# Altium project stm32.PrjPcb
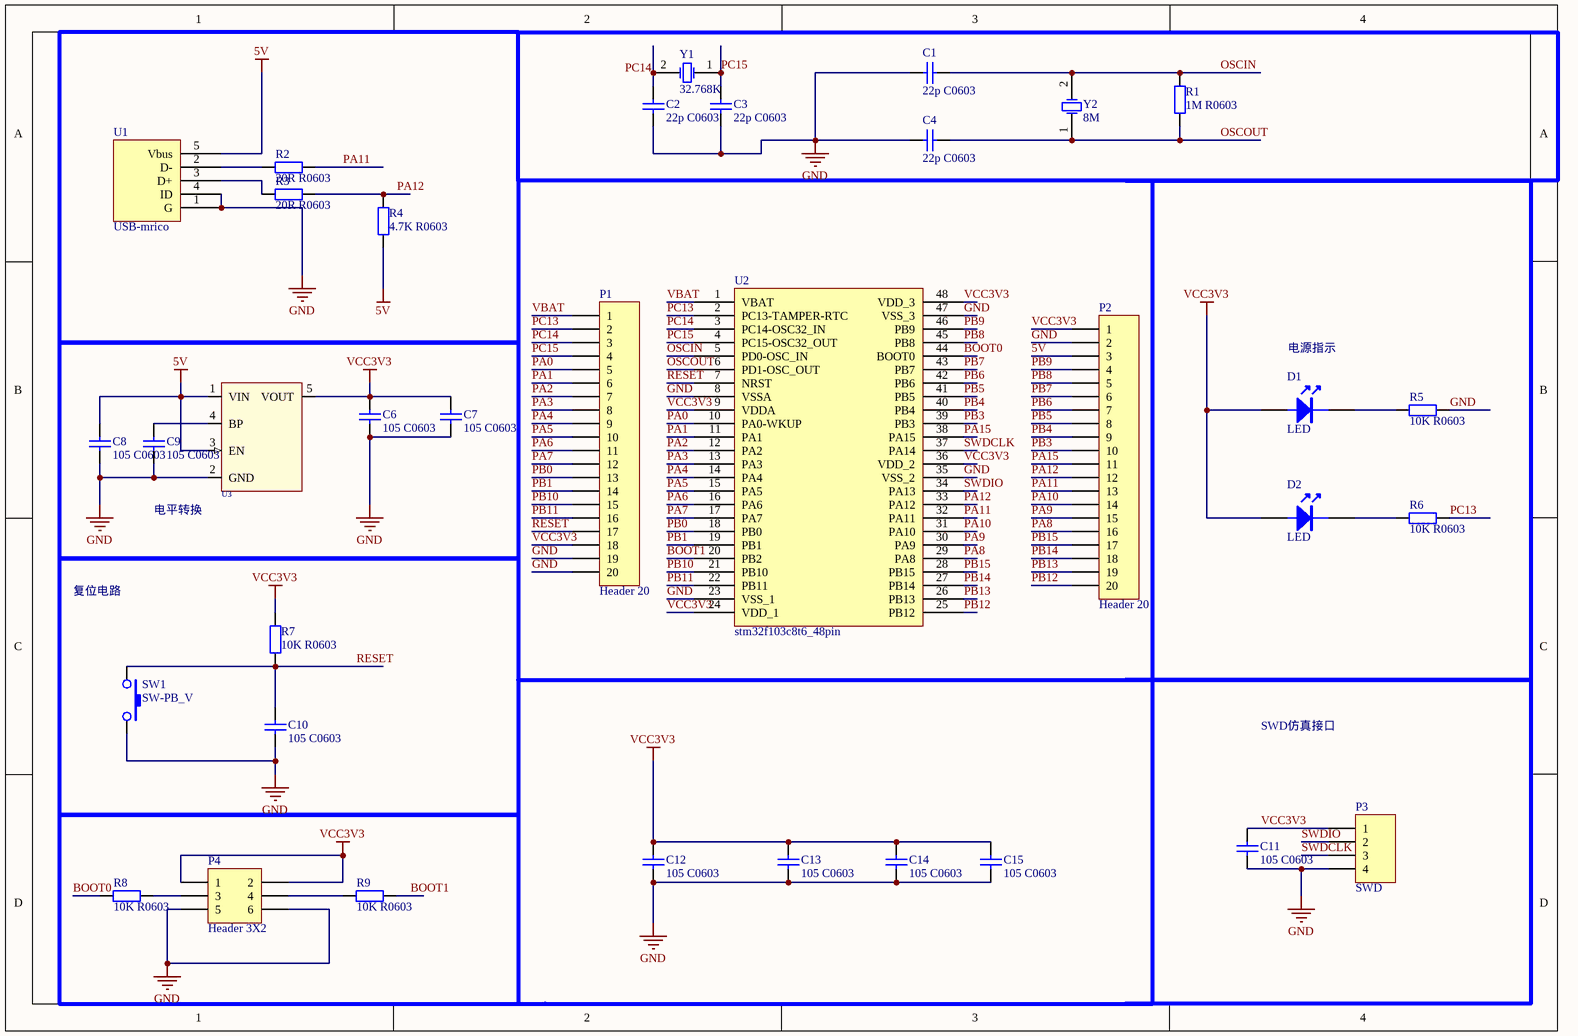
[diagram p0: stm32.SchDoc]
1 sheet, 35 parts. Net scope: global (net labels, ports and power ports of the same name join across sheets).
Board file: stm32.PcbDoc

## Sheet stm32.SchDoc
size A4

### Parts
C1  22p C0603  [C 0603]
C2  22p C0603  [C 0603]
C3  22p C0603  [C 0603]
C4  22p C0603  [C 0603]
C6  105 C0603  [C 0603]
C7  105 C0603  [C 0603]
C8  105 C0603  [C 0603]
C9  105 C0603  [C 0603]
C10  105 C0603  [C 0603]
C11  105 C0603  [C 0603]
C12  105 C0603  [C 0603]
C13  105 C0603  [C 0603]
C14  105 C0603  [C 0603]
C15  105 C0603  [C 0603]
D1  LED  [LED 0805G]
D2  LED  [LED 0805G]
P1  Header 20  [HDR1X20]
P2  Header 20  [HDR1X20]
P3  SWD  [HDR-1X4_H]
P4  Header 3X2  [HDR-3X2]
R1  1M R0603  [R 0603]
R2  20R R0603  [R 0603]
R3  20R R0603  [R 0603]
R4  4.7K R0603  [R 0603]
R5  10K R0603  [R 0603]
R6  10K R0603  [R 0603]
R7  10K R0603  [R 0603]
R8  10K R0603  [R 0603]
R9  10K R0603  [R 0603]
SW1  SW-PB_V  [TSW SMD-3*6*2.5]
U1  USB-mrico  [USB-micro_B]
U2  stm32f103c8t6_48pin  [TQFP48 7x7_L]
U3  RT9193  [SOT23-5L]  (value not drawn)
Y1  32.768K  [XTAL-49S DIP]
Y2  8M  [XTAL-49S DIP]

### Nets
5V: C8.2 P2.3 R4.1 U1.5(Vbus) U3.1(VIN) U3.3(EN)
GND: C1.2 C2.1 C3.1 C4.2 C6.1 C7.1 C8.1 C9.1 C10.1 C11.1 C12.1 C13.1 C14.1 C15.1 P1.19 P1.20 P2.2 P3.4 P4.5 P4.6 R5.2 SW1.2 U1.1(G) U1.4(ID) U2.8(VSSA) U2.23(VSS_1) U2.35(VSS_2) U2.47(VSS_3) U3.2(GND)
VCC3V3: C6.2 C7.2 C11.2 C12.2 C13.2 C14.2 C15.2 D1.1 D2.1 P1.18 P2.1 P3.1 P4.1 P4.2 R7.2 U2.9(VDDA) U2.24(VDD_1) U2.36(VDD_2) U2.48(VDD_3) U3.5(VOUT)
BOOT0: R8.1 U2.44(BOOT0)
BOOT1: R9.2 U2.20(PB2)
OSCIN: C1.1 R1.2 U2.5(PD0-OSC_IN) Y2.2(OSC2)
OSCOUT: C4.1 R1.1 U2.6(PD1-OSC_OUT) Y2.1(OSC1)
PA0: P1.5 U2.10(PA0-WKUP)
PA1: P1.6 U2.11(PA1)
PA2: P1.7 U2.12(PA2)
PA3: P1.8 U2.13(PA3)
PA4: P1.9 U2.14(PA4)
PA5: P1.10 U2.15(PA5)
PA6: P1.11 U2.16(PA6)
PA7: P1.12 U2.17(PA7)
PA8: P2.16 U2.29(PA8)
PA9: P2.15 U2.30(PA9)
PA10: P2.14 U2.31(PA10)
PA11: P2.13 R2.2 U2.32(PA11)
PA12: P2.12 R3.2 R4.2 U2.33(PA12)
PA15: P2.11 U2.38(PA15)
PB0: P1.13 U2.18(PB0)
PB1: P1.14 U2.19(PB1)
PB3: P2.10 U2.39(PB3)
PB4: P2.9 U2.40(PB4)
PB5: P2.8 U2.41(PB5)
PB6: P2.7 U2.42(PB6)
PB7: P2.6 U2.43(PB7)
PB8: P2.5 U2.45(PB8)
PB9: P2.4 U2.46(PB9)
PB10: P1.15 U2.21(PB10)
PB11: P1.16 U2.22(PB11)
PB12: P2.20 U2.25(PB12)
PB13: P2.19 U2.26(PB13)
PB14: P2.18 U2.27(PB14)
PB15: P2.17 U2.28(PB15)
PC13: P1.2 R6.2 U2.2(PC13-TAMPER-RTC)
PC14: C2.2 P1.3 U2.3(PC14-OSC32_IN) Y1.2(OSC2)
PC15: C3.2 P1.4 U2.4(PC15-OSC32_OUT) Y1.1(OSC1)
RESET: C10.2 P1.17 R7.1 SW1.1 U2.7(NRST)
SWDCLK: P3.3 U2.37(PA14)
SWDIO: P3.2 U2.34(PA13)
VBAT: P1.1 U2.1(VBAT)
NetC9_2: C9.2 U3.4(BP)
NetD1_2: D1.2 R5.1
NetD2_2: D2.2 R6.1
NetP4_3: P4.3 R8.2
NetP4_4: P4.4 R9.1
NetR2_1: R2.1 U1.2(D-)
NetR3_1: R3.1 U1.3(D+)

### Notes on the sheet
- 电源指示
- 电平转换
- 复位电路
- SWD仿真接口
- Title
- Size:
- Date:
- A4
- Number:
- Time:
- Revision:
- Sheet
- of
- File:

### Library data of the parts
C1-C4 C6-C15 = Cap: Value: 104; Published: 8-Jun-2000; LatestRevisionDate: 17-Jul-2002; LatestRevisionNote: Re-released for DXP Platform.; Publisher: Altium Limited
P1 P2 = Header1* 20: LatestRevisionDate: 17-Jul-2002; LatestRevisionNote: Re-released for DXP Platform.; Publisher: Altium Limited
P3 = Header 1*4: LatestRevisionDate: 17-Jul-2002; LatestRevisionNote: Re-released for DXP Platform.; Publisher: Altium Limited
P4 = Header 2*3: LatestRevisionDate: 17-Jul-2002; LatestRevisionNote: Re-released for DXP Platform.; Publisher: Altium Limited
R1-R9 = Res2: Published: 8-Jun-2000; LatestRevisionDate: 17-Jul-2002; LatestRevisionNote: Re-released for DXP Platform.; Publisher: Altium Limited
U1 = usb-STM
U3 = RT9193X_5P: ICA_MFR_NAME: RICHTEK; ICA_PARTNUM: $$2191094$$RT9193-15CU5; Part Number: TMP-13
Y1 Y2 = XTAL: Published: 8-Jun-2000; LatestRevisionDate: 17-Jul-2002; LatestRevisionNote: Re-released for DXP Platform.; Publisher: Altium Limited